# EasyEDA schematic 1-Schematic_BlinkingLightBoard2.json
TITLE: Sheet_1; REV: 1.0; Date: 2023-10-25; Sheet: 1/1; Drawn By: adammillion2006; Company: Your Company
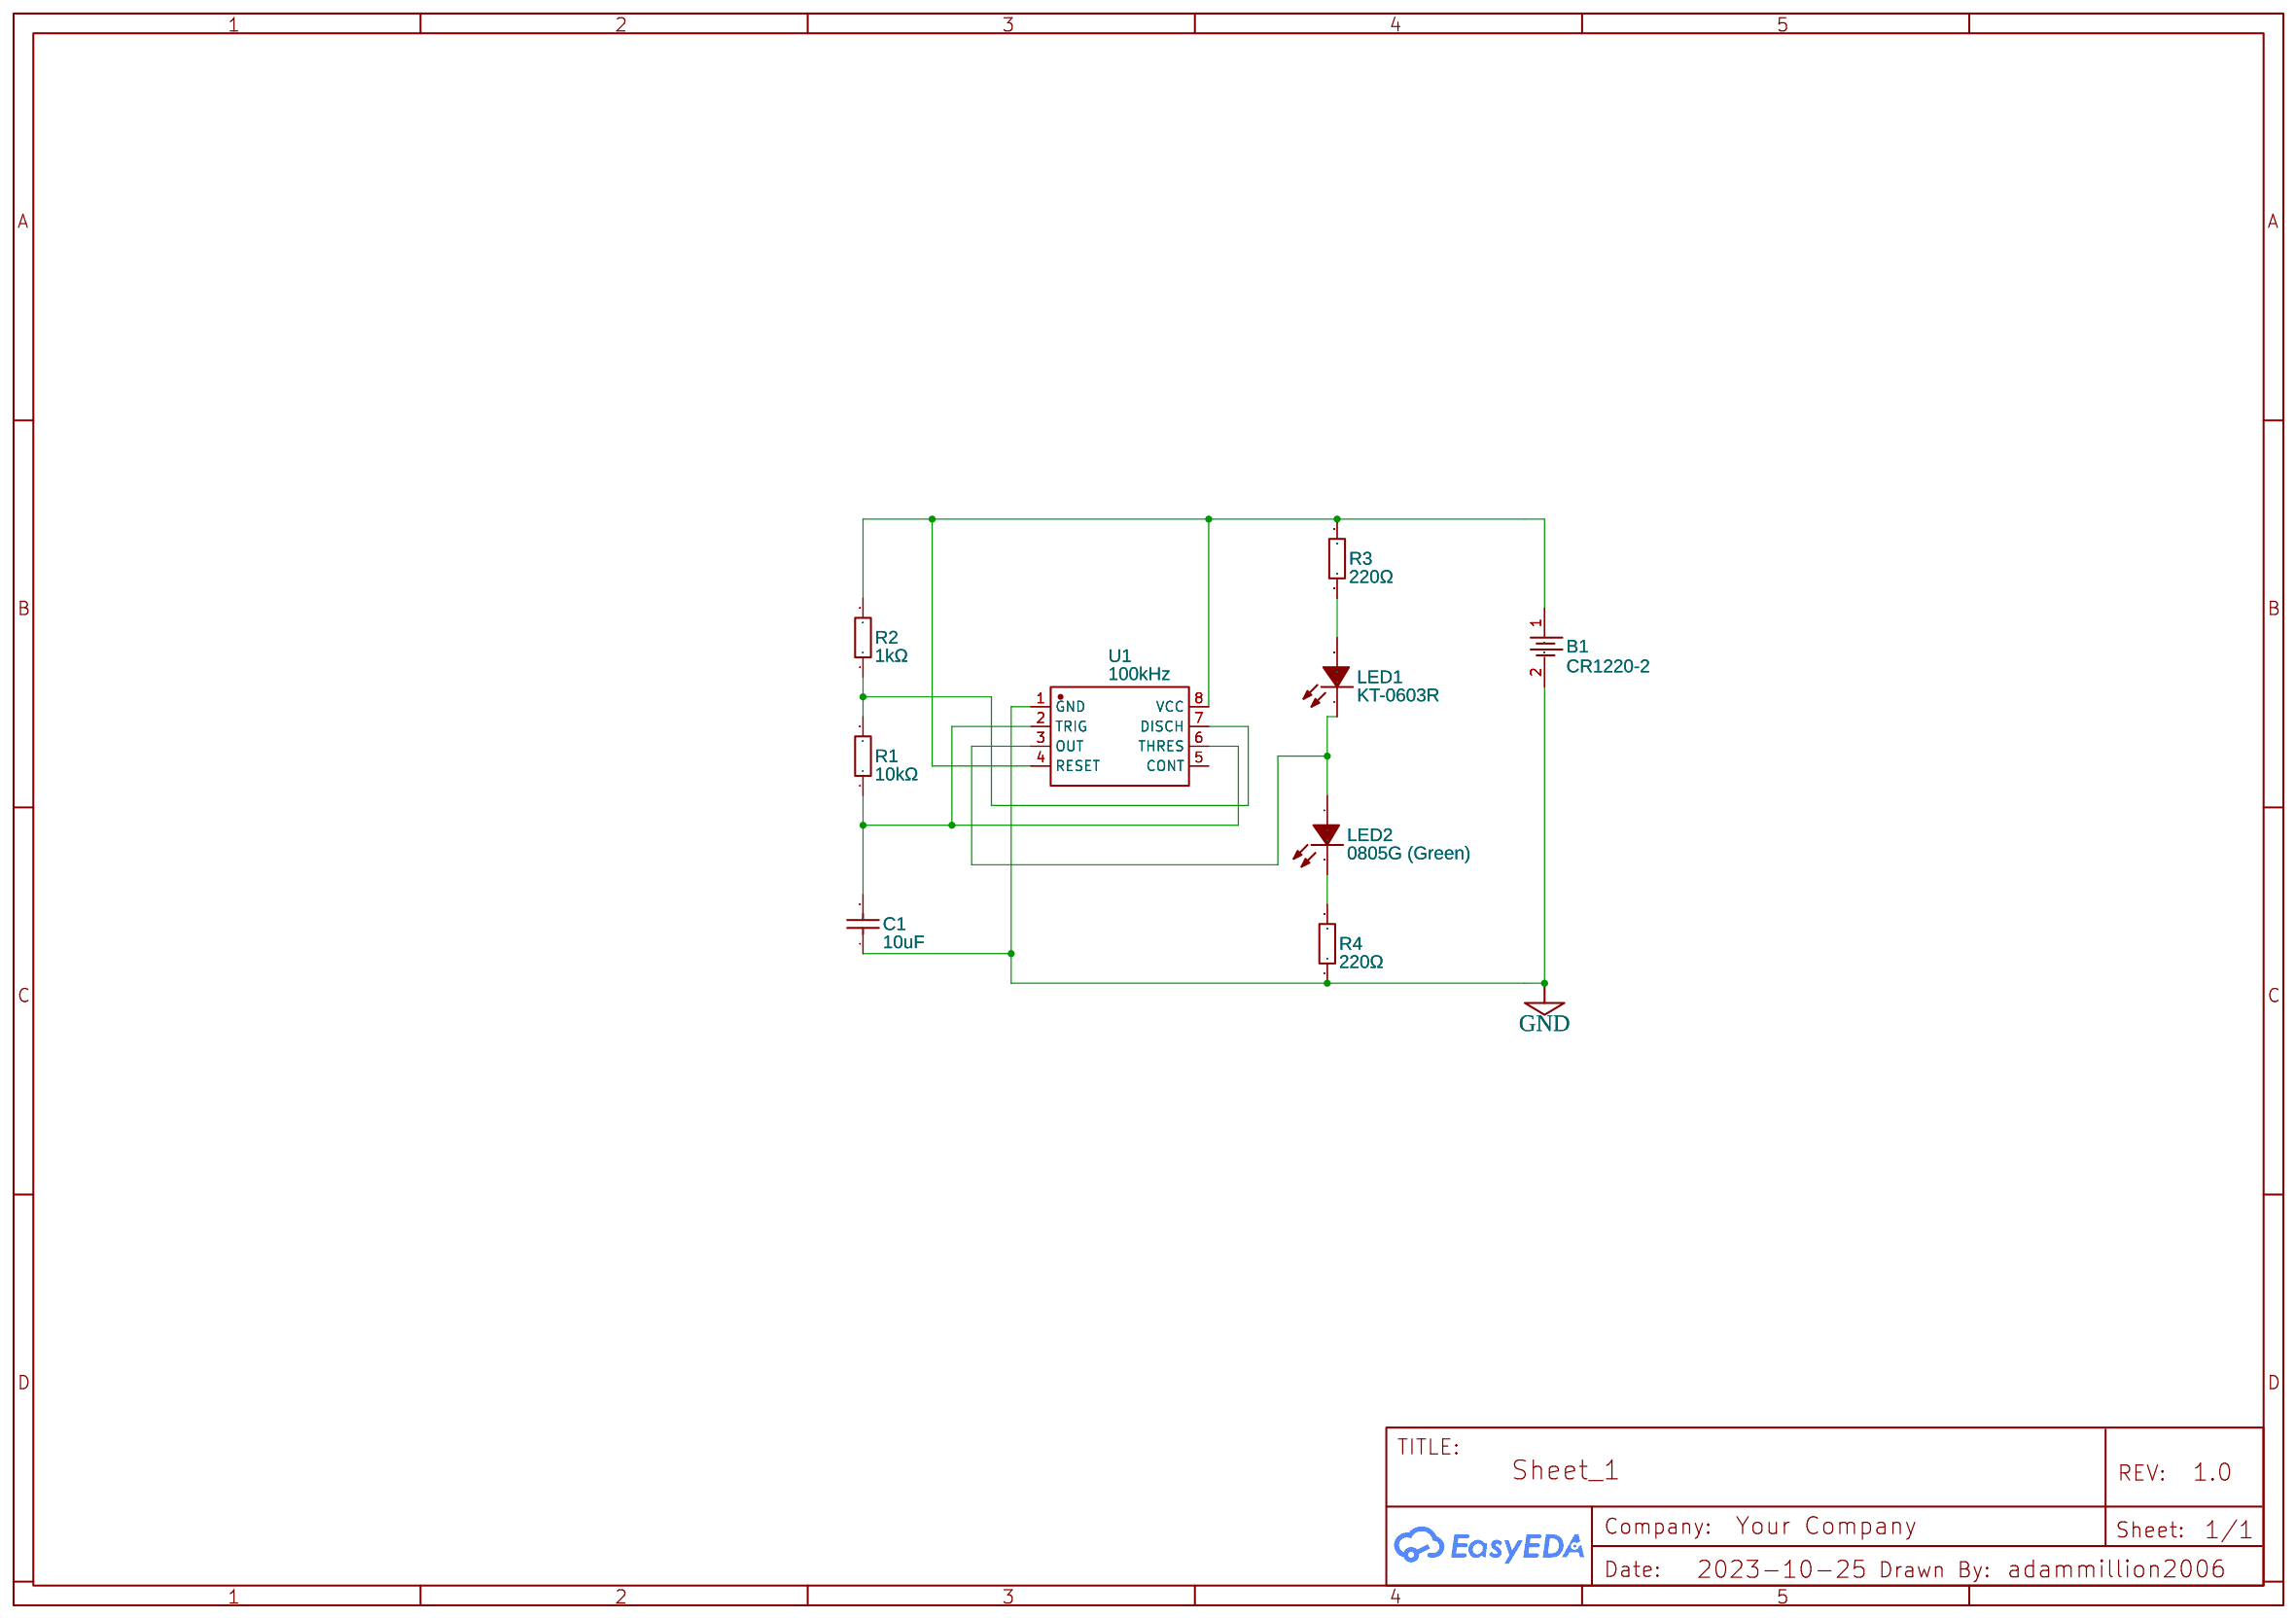
[diagram p0: schematic sheet]

## Parts
B1  CR1220-2  [BAT-SMD_CR1220-2]
C1  10uF  [C0402]
LED1  KT-0603R  [LED0603-RD]
LED2  0805G (Green)  [LED0805-R-RD]
R1  10kΩ  [R0402]
R2  1kΩ  [R0402]
R3  220Ω  [R0603]
R4  220Ω  [R0603]
U1  100kHz  [DIP-8_L9.8-W6.6-P2.54-LS7.6-BL]

## Library data of the parts
B1 = CR1220-2: Supplier: LCSC; Manufacturer: Q&J; image: //image.lceda.cn/szlcsc/C70381.jpg; Supplier Part: C70381
C1 = CL05A106MQ5NUNC: Supplier: LCSC; Manufacturer: SAMSUNG(三星); Supplier Part: C15525; JLCPCB Part Class: Basic Part; link: https://lcsc.com/eda_search?q=C15525&%26type=1&ref=editor
LED1 = KT-0603R: Supplier: LCSC; Manufacturer: KENTO; Supplier Part: C2286; JLCPCB Part Class: Basic Part; link: https://lcsc.com/eda_search?q=C2286&%26type=1&ref=editor
LED2 = 0805G (Green): Supplier: LCSC; Manufacturer: KENTO; Manufacturer Part: KT-0805翠绿; Supplier Part: C2297; JLCPCB Part Class: Basic Part; link: https://lcsc.com/eda_search?q=C2297&%26type=1&ref=editor
R1 = 0402WGF1002TCE: Supplier: LCSC; Manufacturer: UNI-ROYAL(厚声); Supplier Part: C25744; JLCPCB Part Class: Basic Part; link: https://lcsc.com/eda_search?q=C25744&%26type=1&ref=editor
R2 = 0402WGF1001TCE: Supplier: LCSC; Manufacturer: UNI-ROYAL(厚声); Supplier Part: C11702; JLCPCB Part Class: Basic Part; link: https://lcsc.com/eda_search?q=C11702&%26type=1&ref=editor
R3 R4 = 0603WAF2200T5E: Supplier: LCSC; Manufacturer: UNI-ROYAL(厚声); Supplier Part: C22962; JLCPCB Part Class: Basic Part; link: https://lcsc.com/eda_search?q=C22962&%26type=1&ref=editor
U1 = NE555P: Supplier: LCSC; Manufacturer: TI(德州仪器); Supplier Part: C46749; JLCPCB Part Class: Extended Part; link: https://lcsc.com/eda_search?q=C46749&%26type=1&ref=editor

## Nets
GND: B1.2 C1.1 R4.1 U1.1(GND)
Net-(B1-1): B1.1 R2.2 R3.2 U1.4(RESET) U1.8(VCC)
Net-(C1-2): C1.2 R1.1 U1.2(TRIG) U1.6(THRES)
Net-(LED1-1): LED1.1(K) LED2.1(A) U1.3(OUT)
Net-(LED1-2): LED1.2(A) R3.1
Net-(LED2-2): LED2.2(K) R4.2
Net-(R1-2): R1.2 R2.1 U1.7(DISCH)

Not connected (* = marked no-connect by the designer): U1 5(CONT)
